# Altium schematic sheet QCopterFC_SWD_Sch.SchDoc
size A4
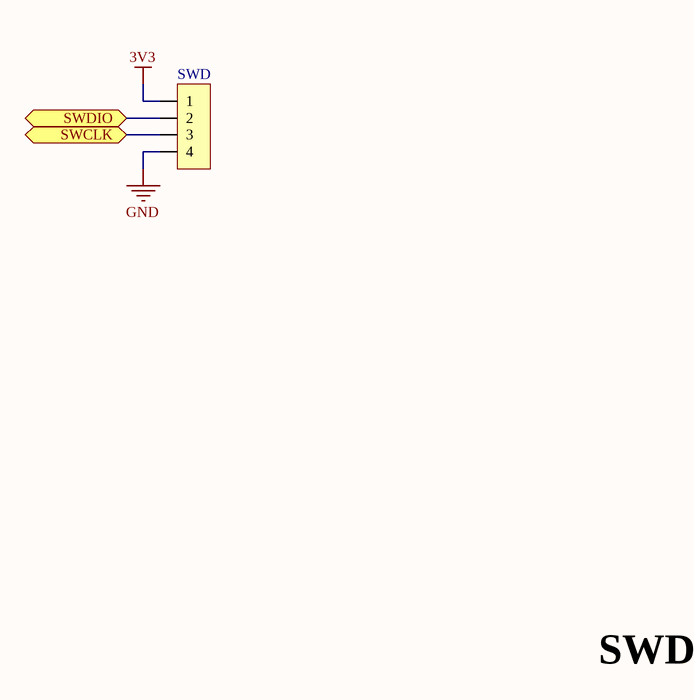
[diagram p0: QCopterFC_SWD_Sch.SchDoc]

## Parts
SWD  HDR1X4_90F_2.54  [HDR1X4_90F_2.54]  (value not drawn)

## Ports
SWCLK, SWDIO

## Nets
3V3: SWD.1
GND: SWD.4
SWCLK: SWD.3 ; port SWCLK
SWDIO: SWD.2 ; port SWDIO

## Notes on the sheet
- SWD

## Library data of the parts
SWD = HDR1X4_90F_2.54: Header